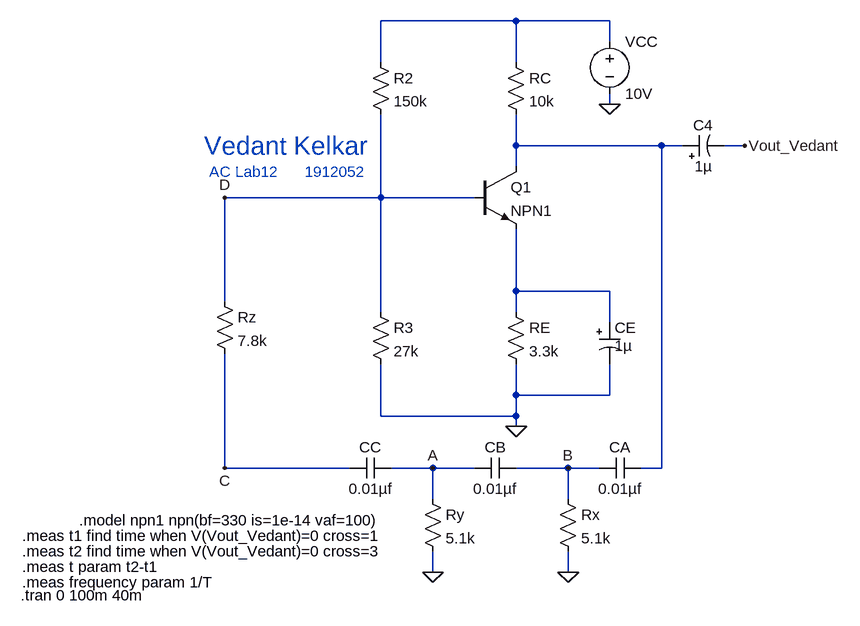
[diagram p0: schematic AC_Lab121.asc]
AC_Lab121.asc, the LTspice schematic file:
Version 4
SHEET 1 880 804
WIRE 240 -96 32 -96
WIRE 384 -96 240 -96
WIRE 384 -64 384 -96
WIRE 32 -32 32 -96
WIRE 240 -32 240 -96
WIRE 384 32 384 16
WIRE 240 96 240 48
WIRE 464 96 240 96
WIRE 496 96 464 96
WIRE 592 96 560 96
WIRE 240 128 240 96
WIRE 32 176 32 48
WIRE 32 176 -208 176
WIRE 176 176 32 176
WIRE 240 320 240 224
WIRE 384 320 240 320
WIRE -208 336 -208 176
WIRE 32 352 32 176
WIRE 240 352 240 320
WIRE 384 368 384 320
WIRE 240 480 240 432
WIRE 384 480 384 432
WIRE 384 480 240 480
WIRE 32 512 32 432
WIRE 240 512 240 480
WIRE 240 512 32 512
WIRE 240 528 240 512
WIRE -208 592 -208 416
WIRE -16 592 -208 592
WIRE 112 592 48 592
WIRE 176 592 112 592
WIRE 320 592 240 592
WIRE 368 592 320 592
WIRE 464 592 464 96
WIRE 464 592 432 592
WIRE 112 640 112 592
WIRE 320 640 320 592
WIRE 112 752 112 720
WIRE 320 752 320 720
FLAG 112 752 0
FLAG 320 752 0
FLAG 112 592 A
FLAG 320 592 B
FLAG 592 96 Vout_Vedant
FLAG -208 592 C
FLAG -208 176 D
FLAG 384 32 0
FLAG 240 528 0
SYMBOL npn 176 128 R0
SYMATTR InstName Q1
SYMATTR Value NPN1
SYMBOL res 224 -48 R0
SYMATTR InstName RC
SYMATTR Value 10k
SYMBOL res 16 -48 R0
SYMATTR InstName R2
SYMATTR Value 150k
SYMBOL res 16 336 R0
SYMATTR InstName R3
SYMATTR Value 27k
SYMBOL res 224 336 R0
SYMATTR InstName RE
SYMATTR Value 3.3k
SYMBOL res -224 320 R0
SYMATTR InstName Rz
SYMATTR Value 7.8k
SYMBOL cap 48 576 R90
WINDOW 0 0 32 VBottom 2
WINDOW 3 32 32 VTop 2
SYMATTR InstName CC
SYMATTR Value 0.01µf
SYMBOL cap 240 576 R90
WINDOW 0 0 32 VBottom 2
WINDOW 3 32 32 VTop 2
SYMATTR InstName CB
SYMATTR Value 0.01µf
SYMBOL cap 432 576 R90
WINDOW 0 0 32 VBottom 2
WINDOW 3 32 32 VTop 2
SYMATTR InstName CA
SYMATTR Value 0.01µf
SYMBOL res 96 624 R0
SYMATTR InstName Ry
SYMATTR Value 5.1k
SYMBOL res 304 624 R0
SYMATTR InstName Rx
SYMATTR Value 5.1k
SYMBOL polcap 496 112 R270
WINDOW 0 32 32 VTop 2
WINDOW 3 0 32 VBottom 2
SYMATTR InstName C4
SYMATTR Value 1µ
SYMATTR Description Capacitor
SYMATTR Type cap
SYMATTR SpiceLine V=16 Irms=0 Rser=11 Lser=0 mfg="AVX" pn="TAJA105K016" type="Tantalum"
SYMBOL voltage 384 -80 R0
WINDOW 123 0 0 Left 0
WINDOW 39 0 0 Left 0
SYMATTR InstName VCC
SYMATTR Value 10V
SYMBOL polcap 368 368 R0
WINDOW 3 24 36 Left 2
SYMATTR InstName CE
SYMATTR Value 1µ
SYMATTR Description Capacitor
SYMATTR Type cap
SYMATTR SpiceLine V=16 Irms=0 Rser=11 Lser=0 mfg="AVX" pn="TAJA105K016" type="Tantalum"
TEXT -240 96 Left 4 ;Vedant Kelkar
TEXT -232 136 Left 2 ;AC Lab12      1912052
TEXT -432 672 Left 2 !.model npn1 npn(bf=330 is=1e-14 vaf=100)
TEXT -520 696 Left 2 !.meas t1 find time when V(Vout_Vedant)=0 cross=1
TEXT -520 720 Left 2 !.meas t2 find time when V(Vout_Vedant)=0 cross=3
TEXT -520 744 Left 2 !.meas t param t2-t1
TEXT -520 768 Left 2 !.meas frequency param 1/T
TEXT -522 788 Left 2 !.tran 0 100m 40m

The netlist it stands for:
* AC_Lab121.asc
Q1 N002 D N003 0 NPN1
RC N001 N002 10k
R2 N001 D 150k
R3 D 0 27k
RE N003 0 3.3k
Rz D C 7.8k
CC A C 0.01µf
CB B A 0.01µf
CA N002 B 0.01µf
Ry A 0 5.1k
Rx B 0 5.1k
C4 N002 Vout_Vedant 1µ V=16 Irms=0 Rser=11 Lser=0 mfg="AVX" pn="TAJA105K016" type="Tantalum"
VCC N001 0 10V
CE N003 0 1µ V=16 Irms=0 Rser=11 Lser=0 mfg="AVX" pn="TAJA105K016" type="Tantalum"
.model NPN NPN
.model PNP PNP
.lib standard.bjt
* Vedant Kelkar
* AC Lab12      1912052
.model npn1 npn(bf=330 is=1e-14 vaf=100)
.meas t1 find time when V(Vout_Vedant)=0 cross=1
.meas t2 find time when V(Vout_Vedant)=0 cross=3
.meas t param t2-t1
.meas frequency param 1/T
.tran 0 100m 40m
.backanno
.end